# Altium project TTAmp_3T0K.PrjPCB
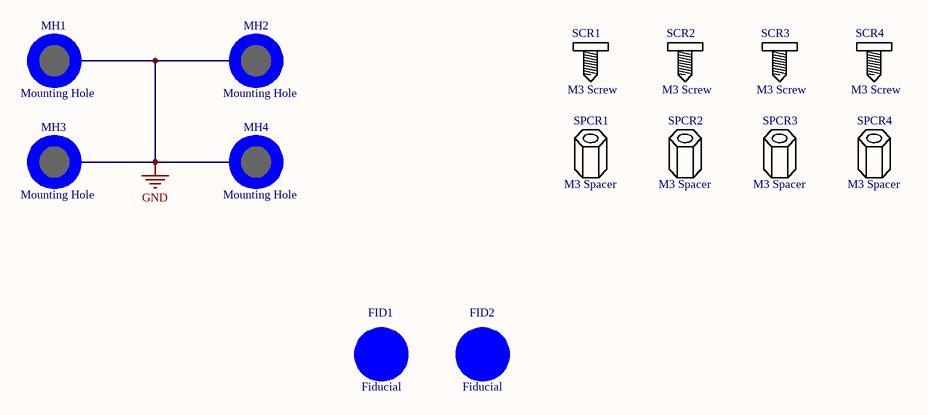
[diagram p0: TTAmp_3T0K_Mechanical.SchDoc]
5 sheets, 153 parts. Net scope: global (net labels, ports and power ports of the same name join across sheets).
Board file: TTAmp_3T0K.PcbDoc
Sheets:
  TTAmp_3T0K_Mechanical.SchDoc
  TTAmp_3T0K_power.SchDoc
  TTAmp_3T0K_amp_tensometer_1.SchDoc
  TTAmp_3T0K_amp_tensometer_2.SchDoc
  TTAmp_3T0K_amp_tensometer_3.SchDoc

## Sheet TTAmp_3T0K_Mechanical.SchDoc
size A4; ApprovedBy: Krzysztof Belewicz; CheckedBy: Krzysztof Belewicz; Author: Krzysztof Belewicz; CompanyName: Koło Naukowe Systemów Scalonych; DrawnBy: Krzysztof Belewicz; Organization: KNSS; Address1: Koło Naukowe; Address2: Systemów Scalonych; Address3: 00-665 Warszawa; Address4: Nowowiejska 15/19; Revision: 0.1; SheetNumber: 5; SheetTotal: 5

### Parts
FID1  Fiducial  [Fiducial]  (no BOM)
FID2  Fiducial  [Fiducial]  (no BOM)
MH1  Mounting Hole  [MH-M3_Copper]  (no BOM)
MH2  Mounting Hole  [MH-M3_Copper]  (no BOM)
MH3  Mounting Hole  [MH-M3_Copper]  (no BOM)
MH4  Mounting Hole  [MH-M3_Copper]  (no BOM)
SCR1  M3 Screw  (mechanical)
SCR2  M3 Screw  (mechanical)
SCR3  M3 Screw  (mechanical)
SCR4  M3 Screw  (mechanical)
SPCR1  M3 Spacer  (mechanical)
SPCR2  M3 Spacer  (mechanical)
SPCR3  M3 Spacer  (mechanical)
SPCR4  M3 Spacer  (mechanical)

### Nets
GND: MH1.MH MH2.MH MH3.MH MH4.MH

### Notes on the sheet
- Project:
- Variant:
- File:
- Sheet:
- Revision:
- Total Sheet:
- Author:
- Modified:

### Library data of the parts
FID1 FID2 = FID
MH1-MH4 = MH: M3 mounting hole
SCR1-SCR4 = SCREW: Supplier 1: *; Manufacturer 1: *; Supplier Part Number 1: *; Manufacturer Part Number 1: *
SPCR1-SPCR4 = SPCR: Supplier 1: *; Manufacturer 1: *; Supplier Part Number 1: *; Manufacturer Part Number 1: *

## Sheet TTAmp_3T0K_power.SchDoc
size A4; ApprovedBy: Krzysztof Belewicz; CheckedBy: Krzysztof Belewicz; Author: Krzysztof Belewicz; CompanyName: Koło Naukowe Systemów Scalonych; DrawnBy: Krzysztof Belewicz; Organization: KNSS; Address1: Koło Naukowe; Address2: Systemów Scalonych; Address3: 00-665 Warszawa; Address4: Nowowiejska 15/19; Revision: 0.1; SheetNumber: 1; SheetTotal: 5
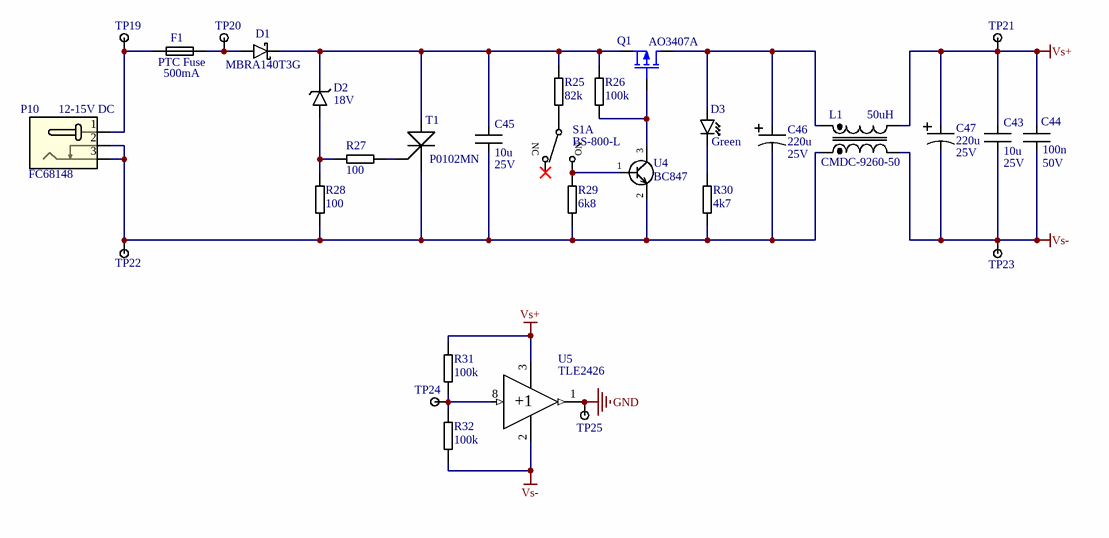
[diagram p1: TTAmp_3T0K_power.SchDoc]

### Parts
(Parts that share a designator on the sheet are numbered #1, #2 ... from top to bottom, then left to right.)
C43  value 10u  MaxVoltage: 25V  [CAPC2012N]  (hidden comment: Capacitor)
C44  value 100n  MaxVoltage: 50V  [CAPC1608N]  (hidden comment: Capacitor)
C45  value 10u  MaxVoltage: 25V  [CAPC2012N]  (hidden comment: Capacitor)
C46  value 220u  MaxVoltage: 25V  [8x10]  (hidden comment: SC1E227M08010VR)
C47  value 220u  MaxVoltage: 25V  [8x10]  (hidden comment: SC1E227M08010VR)
D1  MBRA140T3G  [SMA]
D2  value 18V  [SOD123]  (hidden comment: Zener Diode)
D3  Green  [LED_0603_GREEN]
F1  PTC Fuse  value 500mA  [RESC4532N]
L1  CMDC-9260-50  value 50uH  [CMDC-09260 HF]
P10  12-15V DC  [FC681478]
Q1  AO3407A  [SOT23-3N]
R25  value 82k  [RESC1608N]  (hidden comment: Resistor)
R26  value 100k  [RESC1608N]  (hidden comment: Resistor)
R27  value 100  [RESC1608N]  (hidden comment: Resistor)
R28  value 100  [RESC1608N]  (hidden comment: Resistor)
R29  value 6k8  [RESC1608N]  (hidden comment: Resistor)
R30  value 4k7  [RESC1608N]  (hidden comment: Resistor)
R31  value 100k  [RESC1608N]  (hidden comment: Resistor)
R32  value 100k  [RESC1608N]  (hidden comment: Resistor)
S1#1  BS-800-L  [BS-800-L]  (part A of 2)
T1  P0102MN  [SOT223_N]
TP19  (no value)  [TP-SMD-1.0MM]  (no BOM)
TP20  (no value)  [TP-SMD-1.0MM]  (no BOM)
TP21  (no value)  [TP-SMD-1.0MM]  (no BOM)
TP22  (no value)  [TP-SMD-1.0MM]  (no BOM)
TP23  (no value)  [TP-SMD-1.0MM]  (no BOM)
TP24  (no value)  [TP-SMD-1.0MM]  (no BOM)
TP25  (no value)  [TP-SMD-1.0MM]  (no BOM)
U4  BC847  [SOT323_L]
U5  TLE2426  [SOIC8]

### Nets
GND: TP25.1 U5.1(OUT)
Vs+: C43.2 C44.2 C47.1 L1.4 R31.2 TP21.1 U5.3(IN)
Vs-: C43.1 C44.1 C47.2 L1.3 R32.1 TP23.1 U5.2(COMMON)
NetC45_1: C45.1 C46.2 L1.2 P10.2 P10.3 R28.1 R29.1 R30.1 T1.1(K) TP22.1 U4.2(E)
NetC45_2: C45.2 D1.2 D2.2 Q1.2(S) R25.2 R26.2 T1.2(A)
NetC46_1: C46.1 D3.A L1.1 Q1.3(D)
NetD1_1: D1.1 F1.2 TP20.1
NetD2_1: D2.1 R27.2 R28.2
NetD3_K: D3.K R30.2
NetF1_1: F1.1 P10.1 TP19.1
NetQ1_1: Q1.1(G) R26.1 U4.3(C)
NetR25_1: R25.1 S1#1.2(COM_1)
NetR27_1: R27.1 T1.3(G)
NetR29_2: R29.2 S1#1.3(NO_1) U4.1(B)
NetR31_1: R31.1 R32.2 TP24.1 U5.8(NOISE_REDUCTION)

Not connected (* = marked no-connect by the designer): S1#1 1(NC_1)*

### Notes on the sheet
- Project:
- Variant:
- File:
- Sheet:
- Revision:
- Total Sheet:
- Author:
- Modified:
- (in symbol BS-800-L, part A) NC; NO
- (in symbol TLE2426) +1

### Library data of the parts
C43-C45 = Capacitor: Tolerance: 10%; Supplier 1: TME; Supplier 2: *
  C43 C45: Supplier Part Number 1: GRM21BR61E106KA73L
  C44: Supplier Part Number 1: CL10B104KB8NNNC
C46 C47 = Capacitor Polarized: Manufacturer 1: SAMWHA; Tolerance: 20%; Supplier 1: TME; Supplier Part Number 1: SC1E227M08010VR; Manufacturer Part Number 1: SC1E227M08010VR
D1 = MBRA140T3G: Dioda: prostownicza Schottky; SMD; 40V; 1A; SMA; pin to pad: 1>A 2>K; Manufacturer 1: ON SEMICONDUCTOR; Supplier 1: TME; Supplier Part Number 1: MBRA140T3G; Manufacturer Part Number 1: MBRA140T3G
D2 = MMSZ5227BT1G: Zener Diode 18V 0.5W smd SOD123; Manufacturer 1: ON SEMICONDUCTOR; Manufacturer Part Number 1: MMSZ18T1G; Supplier 1: TME; Supplier Part Number 1: MMSZ18T1G
D3 = LED_SMD_0603: LED 0603; Manufacturer 1: OPTOSUPPLY; Manufacturer Part Number 1: OSG80603C1E; Voltage: 1.6-2.4V; MaxCurrent: 5mA; Supplier 1: TME; Supplier Part Number 1: OSG80603C1E; Color: Green
F1 = SD075-16: PTC Fuse 750mA; Manufacturer 1: ECE; Manufacturer Part Number 1: SD050-16; Max Voltage: 16V; Supplier 1: TME; Supplier Part Number 1: SD075-16; Supplier 2: *; Supplier Part Number 2: *; Stand Current: 500mA
L1 = CMDC-9260-50: Dławik: common mode; SMD; 800mA; 320mΩ; Ind.poj.uzw:50uH; Il.uzw:2; Manufacturer 1: FERROCORE; Max Voltage: 80VDC; Resistance: 320mOhm; Manufacturer Part Number 1: CMDC-9260-50; Supplier 1: TME; Supplier Part Number 1: CMDC-9260-50; Max Current: 800mA
P10 = FC68148: Socket; Barrel jack DC; male; 5,5/2,1mm; THT; Manufacturer Part Number 1: DC-10A FC68148; Manufacturer 1: Cliff; Max Voltage: 12VDC; Max Current: 5A; Supplier 1: TME; Supplier Part Number 1: FC68148
Q1 = MOSFET-P: P-Channel MOSFET; Manufacturer 1: ALPHA & OMEGA SEMICONDUCTOR; Supplier Part Number 1: AO3407A; Supplier 1: TME; Manufacturer Part Number 1: AO3407A
R25 = Resistor: Manufacturer 1: WALSIN; Manufacturer Part Number 1: WF06P823JTL; Tolerance: 5%; Power: 0.125W; Supplier 1: TME; Supplier Part Number 1: WF06P-82K-5%
R26 R31 R32 = Resistor: Manufacturer 1: ROYAL OHM; Manufacturer Part Number 1: HP03W5J0104T5E; Tolerance: 5%; Power: 0.2W; Supplier 1: TME; Supplier Part Number 1: HP03-100K5%
R27 = Resistor: Manufacturer 1: WALSIN; Manufacturer Part Number 1: WF06P101JTL; Tolerance: 5%; Power: 0.125W; Supplier 1: TME; Supplier Part Number 1: WF06P-100R-5%
R28 = Resistor: Manufacturer Part Number 1: WF06P101JTL; Manufacturer 1: WALSIN; Tolerance: 5%; Power: 0.125W; Supplier 1: TME; Supplier Part Number 1: WF06P-100R-5%
R29 = Resistor: Manufacturer Part Number 1: RC0603JR-076K8L; Manufacturer 1: YAGEO; Tolerance: 5%; Power: 0.1W; Supplier 1: TME; Supplier Part Number 1: RC0603JR-076K8
R30 = Resistor: Manufacturer Part Number 1: WF06P472JTL; Manufacturer 1: WALSIN; Tolerance: 5%; Power: 0.125W; Supplier 1: TME; Supplier Part Number 1: WF06P-4K7-5%
S1#1 = BS-800-L: Manufacturer 1: CANAL ELECTRONIC; Max Current: 0.1A; Max Voltage: 30VDC; Manufacturer Part Number 1: BS-800-L; Supplier Part Number 1: BS800L; Supplier 1: TME
T1 = P0102MN 5AA4: Manufacturer 1: ST MICROELECTRONICS; Manufacturer Part Number 1: P0102MN 5AA4; Supplier 1: TME; Supplier Part Number 1: P0102MN-5AA4
TP19-TP25 = TP1: Test Point for probe
U4 = BC847AW.115: Tranzystor: NPN; bipolarny; 45V; 200mA; 200mW; SOT323; Manufacturer 1: NEXPERIA; Manufacturer Part Number 1: BC847AW.115; Supplier 1: TME; Supplier Part Number 1: BC847AW.115
U5 = TLE2426: Texas Instrument Low-Noise JFET-Input Operational Amplifier; Manufacturer 1: TEXAS INSTRUMENTS; Manufacturer Part Number 1: TLE2426ID; Supplier 1: Farnell; Supplier Part Number 1: 8454833

## Sheet TTAmp_3T0K_amp_tensometer_1.SchDoc
size A4; ApprovedBy: Krzysztof Belewicz; CheckedBy: Krzysztof Belewicz; Author: Krzysztof Belewicz; CompanyName: Koło Naukowe Systemów Scalonych; DrawnBy: Krzysztof Belewicz; Organization: KNSS; Address1: Koło Naukowe; Address2: Systemów Scalonych; Address3: 00-665 Warszawa; Address4: Nowowiejska 15/19; Revision: 0.1; SheetNumber: 2; SheetTotal: 5
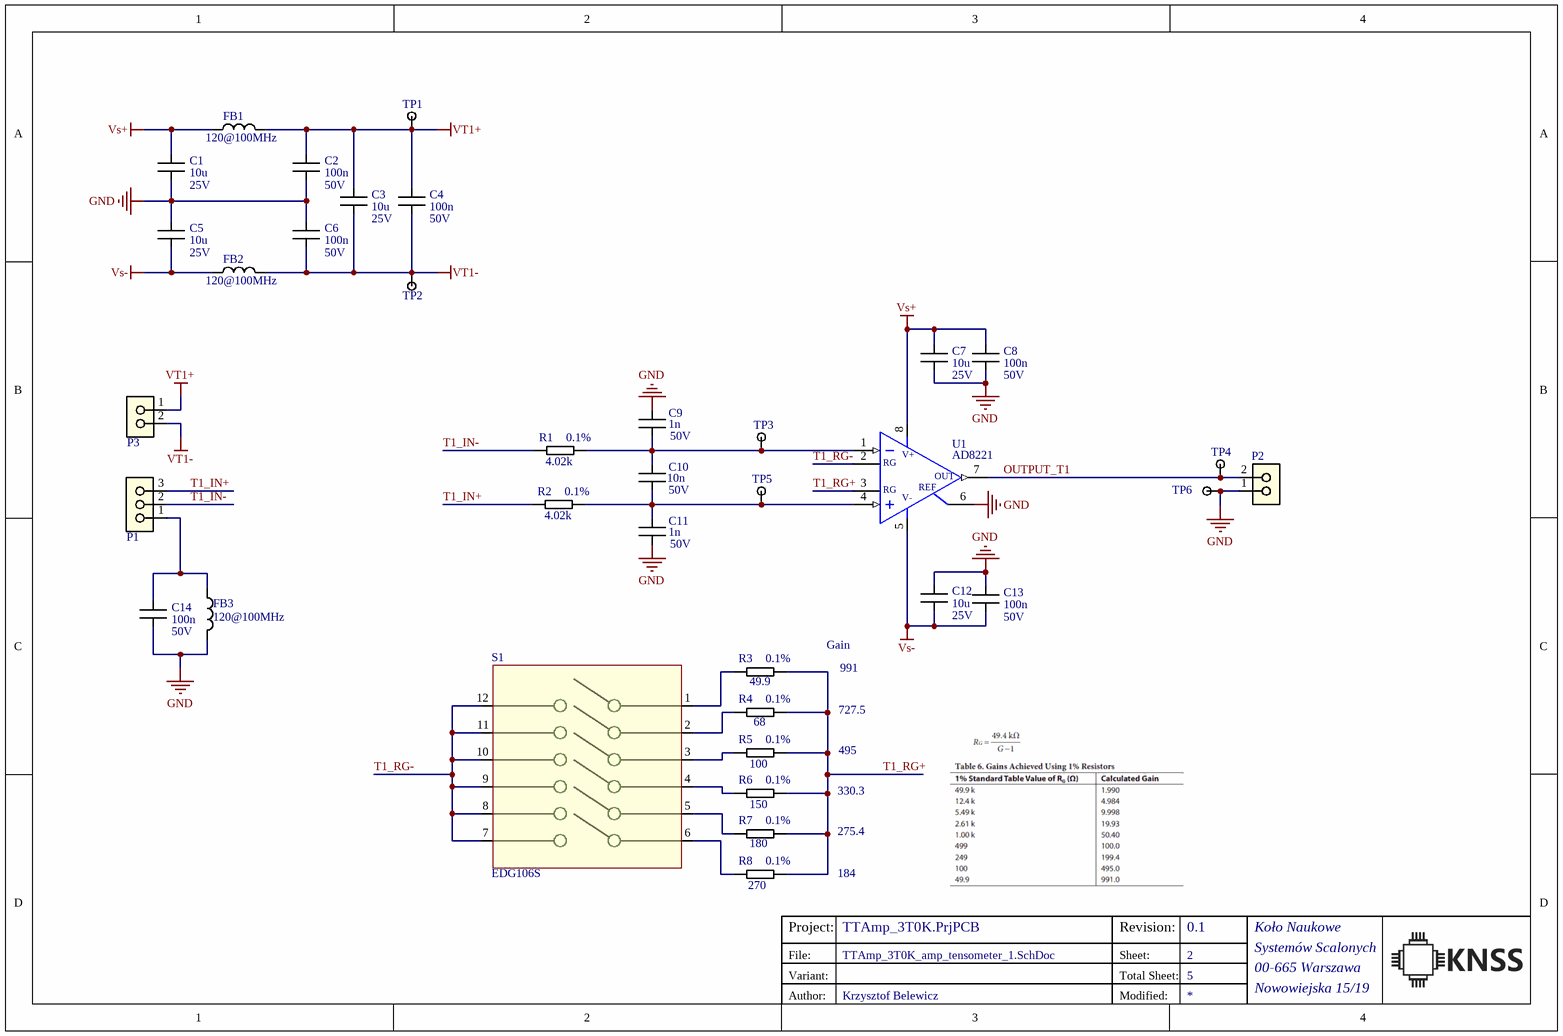
[diagram p2: TTAmp_3T0K_amp_tensometer_1.SchDoc]

### Parts
(Parts that share a designator on the sheet are numbered #1, #2 ... from top to bottom, then left to right.)
C1  value 10u  MaxVoltage: 25V  [CAPC2012N]  (hidden comment: Capacitor)
C2  value 100n  MaxVoltage: 50V  [CAPC1608N]  (hidden comment: Capacitor)
C3  value 10u  MaxVoltage: 25V  [CAPC2012N]  (hidden comment: Capacitor)
C4  value 100n  MaxVoltage: 50V  [CAPC1608N]  (hidden comment: Capacitor)
C5  value 10u  MaxVoltage: 25V  [CAPC2012N]  (hidden comment: Capacitor)
C6  value 100n  MaxVoltage: 50V  [CAPC1608N]  (hidden comment: Capacitor)
C7  value 10u  MaxVoltage: 25V  [CAPC2012N]  (hidden comment: Capacitor)
C8  value 100n  MaxVoltage: 50V  [CAPC1608N]  (hidden comment: Capacitor)
C9  value 1n  MaxVoltage: 50V  [CAPC1608N]  (hidden comment: Capacitor)
C10  value 10n  MaxVoltage: 50V  [CAPC1608N]  (hidden comment: Capacitor)
C11  value 1n  MaxVoltage: 50V  [CAPC1608N]  (hidden comment: Capacitor)
C12  value 10u  MaxVoltage: 25V  [CAPC2012N]  (hidden comment: Capacitor)
C13  value 100n  MaxVoltage: 50V  [CAPC1608N]  (hidden comment: Capacitor)
C14  value 100n  MaxVoltage: 50V  [CAPC1608N]  (hidden comment: Capacitor)
FB1  value 120@100MHz  [INDC1608N]  (hidden comment: Ferrite Bead)
FB2  value 120@100MHz  [INDC1608N]  (hidden comment: Ferrite Bead)
FB3  value 120@100MHz  [INDC1608N]  (hidden comment: Ferrite Bead)
P1  AK100/3DS-5,0-V/GRAU  [AK100/3DS-5,0-V/GRAU]  (value not drawn)
P2  AK100/2DS-5,0-V/GRAU  [AK100/2DS-5,0-V/GRAU]  (value not drawn)
P3  AK100/2DS-5,0-V/GRAU  [AK100/2DS-5,0-V/GRAU]  (value not drawn)
R1  value 4.02k  Tolerance: 0.1%  [RESC1608N]  (hidden comment: Resistor)
R2  value 4.02k  Tolerance: 0.1%  [RESC1608N]  (hidden comment: Resistor)
R3  value 49.9  Tolerance: 0.1%  [RESC1608N]  (hidden comment: Resistor)
R4  value 68  Tolerance: 0.1%  [RESC1608N]  (hidden comment: Resistor)
R5  value 100  Tolerance: 0.1%  [RESC1608N]  (hidden comment: Resistor)
R6  value 150  Tolerance: 0.1%  [RESC1608N]  (hidden comment: Resistor)
R7  value 180  Tolerance: 0.1%  [RESC1608N]  (hidden comment: Resistor)
R8  value 270  Tolerance: 0.1%  [RESC1608N]  (hidden comment: Resistor)
S1#2  EDG106S  [EDG106S]
TP1  (no value)  [TP-SMD-1.0MM]  (no BOM)
TP2  (no value)  [TP-SMD-1.0MM]  (no BOM)
TP3  (no value)  [TP-SMD-1.0MM]  (no BOM)
TP4  (no value)  [TP-SMD-1.0MM]  (no BOM)
TP5  (no value)  [TP-SMD-1.0MM]  (no BOM)
TP6  (no value)  [TP-SMD-1.0MM]  (no BOM)
U1  AD8221  [R-8_N]

### Nets
GND: C1.1 C2.1 C5.2 C6.2 C7.1 C8.1 C9.2 C11.1 C12.2 C13.2 C14.1 FB3.2 P2.1 TP6.1 U1.6(REF)
Vs+: C1.2 C7.2 C8.2 FB1.2 U1.8(V+)
Vs-: C5.1 C12.1 C13.1 FB2.2 U1.5(V-)
VT1+: C2.2 C3.2 C4.2 FB1.1 P3.1 TP1.1
VT1-: C3.1 C4.1 C6.1 FB2.1 P3.2 TP2.1
OUTPUT_T1: P2.2 TP4.1 U1.7(OUT)
T1_IN+: P1.3 R2.2
T1_IN-: P1.2 R1.2
T1_RG+: R3.1 R4.1 R5.1 R6.1 R7.1 R8.1 U1.3(RG)
T1_RG-: S1#2.7 S1#2.8 S1#2.9 S1#2.10 S1#2.11 S1#2.12 U1.2(RG)
NetC9_1: C9.1 C10.2 R1.1 TP3.1 U1.1(-IN)
NetC10_1: C10.1 C11.2 R2.1 TP5.1 U1.4(+IN)
NetC14_2: C14.2 FB3.1 P1.1
NetR3_2: R3.2 S1#2.1
NetR4_2: R4.2 S1#2.2
NetR5_2: R5.2 S1#2.3
NetR6_2: R6.2 S1#2.4
NetR7_2: R7.2 S1#2.5
NetR8_2: R8.2 S1#2.6

### Notes on the sheet
- Gain
- 727.5
- 991
- 495
- 330.3
- 275.4
- 184
- Project:
- Variant:
- File:
- Sheet:
- Revision:
- Total Sheet:
- Author:
- Modified:

### Library data of the parts
C1-C9 C11-C14 = Capacitor: Tolerance: 10%; Supplier 1: TME; Supplier 2: *
  C1 C3 C5 C7 C12: Supplier Part Number 1: GRM21BR61E106KA73L
  C2 C4 C6 C8 C13 C14: Supplier Part Number 1: CL10B104KB8NNNC
  C9 C11: Supplier Part Number 1: VJ0603Y102KXACW1BC
C10 = Capacitor: Tolerance: 20%; Supplier 1: TME; Supplier 2: *; Supplier Part Number 1: VJ0603Y103MXACW1BC
FB1-FB3 = Inductor: Max Current: 3A; Tolerance: *; Supplier 1: TME; Supplier 2: *; Supplier Part Number 1: BLM18KG121TN1D
P1 = AK100/3DS-5,0-V/GRAU: Listwa zaciskowa do druku; kątowe 90°; 5mm; tory:3; na PCB; 24A; Manufacturer: PTR MESSTECHNIK; Supplier Part Number 1: TB-5.0-P-3P-12; Supplier 1: TME; Manufacturer Part Number: AK100/3DS-5,0-V/GRAU
P2 P3 = AK100/2DS-5,0-V/GRAU: Listwa zaciskowa do druku; kątowe 90°; 5mm; tory:2; na PCB; 24A; Manufacturer: PTR MESSTECHNIK; Supplier Part Number 1: TB-5.0-P-2P-12; Supplier 1: TME; Manufacturer Part Number: AK100/2DS-5,0-V/GRAU
R1 R2 = Resistor: Manufacturer Part Number 1: AR03BTCX4021; Manufacturer 1: VIKING; Power: 0.1W; Supplier 1: TME; Supplier Part Number 1: AR0603-4K02-0.1%
R3 = Resistor: Manufacturer 1: VIKING; Manufacturer Part Number 1: AR03BTCX49R9; Power: 0.1W; Supplier 1: TME; Supplier Part Number 1: AR0603-49R9-0.1%
R4 = Resistor: Manufacturer Part Number 1: AR03BTCX0680; Manufacturer: VIKING; Power: 0.1W; Supplier 1: TME; Supplier Part Number 1: AR0603-68R-0.1%
R5 = Resistor: Manufacturer Part Number 1: AR03BTCX1000; Manufacturer 1: VIKING; Power: 0.1W; Supplier 1: TME; Supplier Part Number 1: AR0603-100R-0.1%
R6 = Resistor: Manufacturer Part Number 1: AR03BTCX1500; Manufacturer 1: VIKING; Power: 0.1W; Supplier 1: TME; Supplier Part Number 1: AR0603-150R-0.1%
R7 = Resistor: Manufacturer Part Number 1: AR03BTCX1800; Manufacturer 1: VIKING; Power: 0.1W; Supplier 1: TME; Supplier Part Number 1: AR0603-180R-0.1%
R8 = Resistor: Manufacturer Part Number 1: AR03BTCX2700; Manufacturer 1: VIKING; Power: 0.1W; Supplier 1: TME; Supplier Part Number 1: AR0603-180R-0.1%
S1#2 = EDG106S: Przełącznik: DIP-SWITCH; Ilość sekcji:6; ON-OFF; 0,1A/24VDC; 500V; Manufacturer 1: ECE; Manufacturer Part Number 1: EDG106S; Supplier 1: TME; Supplier Part Number 1: EDG106S
TP1-TP6 = TP1: Test Point for probe
U1 = AD8221: Precision Instrumentation Amplifier; Manufacturer Part Number 1: AD8221BRZ; Manufacturer 1: ANALOG DEVICES; PackageReference 1: SOIC_N; ComponentLink1Description: Manufacturer Link; ComponentLink1URL: http://www.analog.com/en/prod/0%2C2877%2CAD622%2C00.html; ComponentLink2Description: Datasheet; ComponentLink2URL: http://www.analog.com/UploadedFiles/Data_Sheets/218546992AD622_c.pdf; Supplier 1: TME; Supplier Part Number 1: AD8221BRZ

## Sheet TTAmp_3T0K_amp_tensometer_2.SchDoc
size A4; ApprovedBy: Krzysztof Belewicz; CheckedBy: Krzysztof Belewicz; Author: Krzysztof Belewicz; CompanyName: Koło Naukowe Systemów Scalonych; DrawnBy: Krzysztof Belewicz; Organization: KNSS; Address1: Koło Naukowe; Address2: Systemów Scalonych; Address3: 00-665 Warszawa; Address4: Nowowiejska 15/19; Revision: 0.1; SheetNumber: 3; SheetTotal: 5
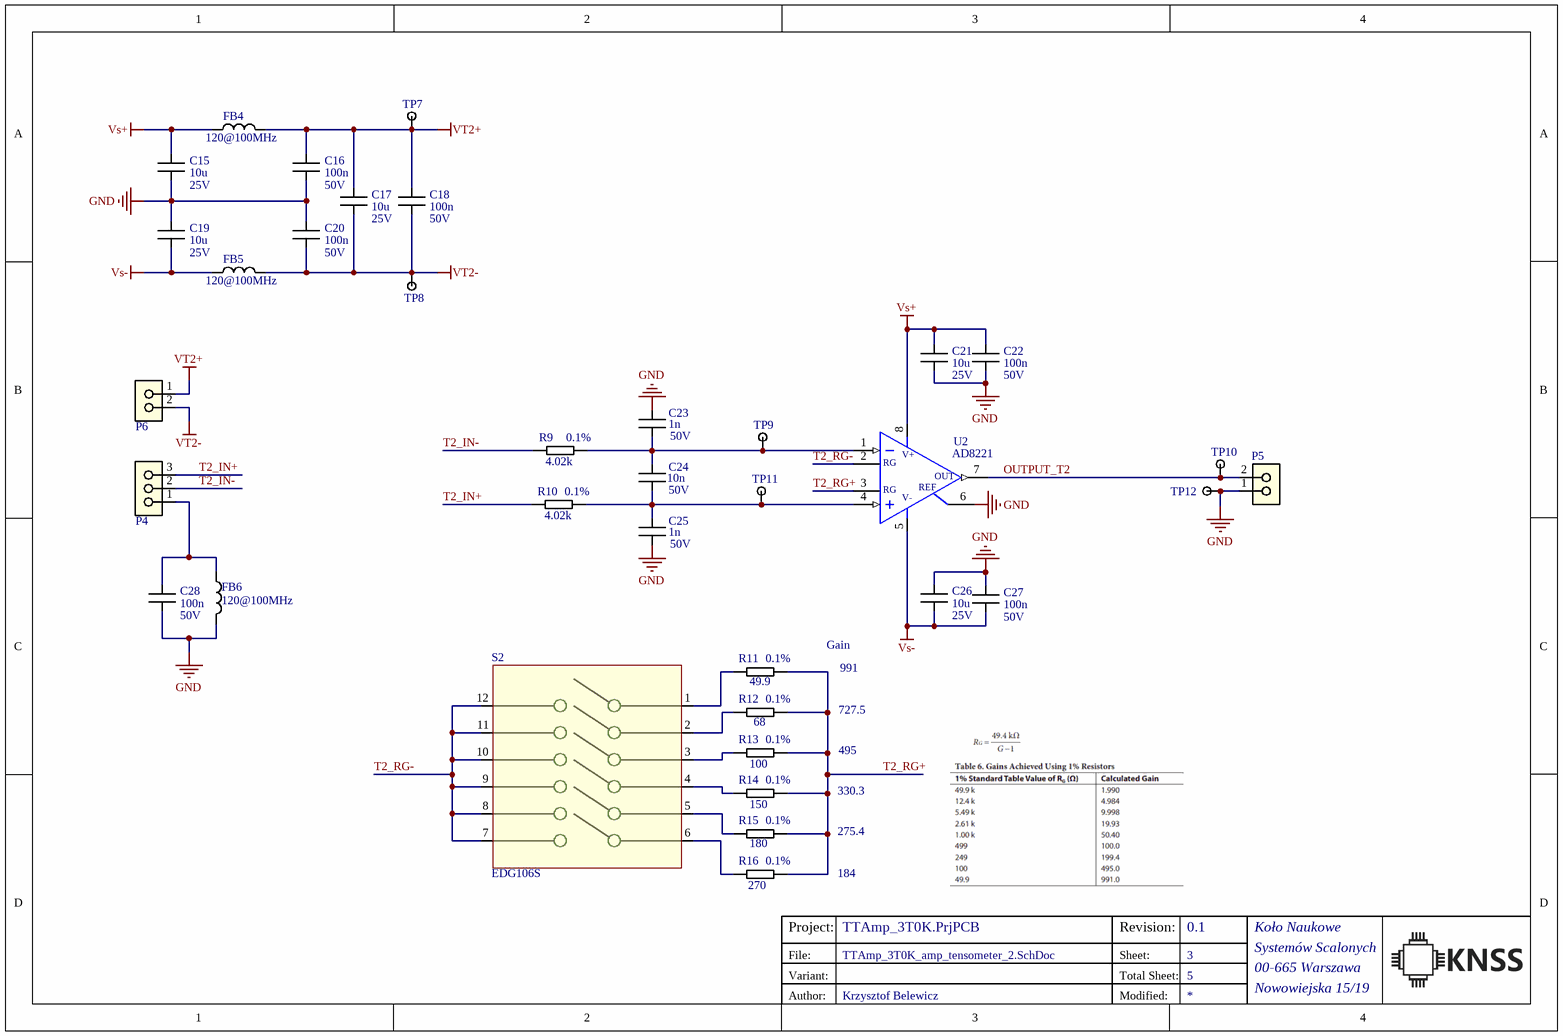
[diagram p3: TTAmp_3T0K_amp_tensometer_2.SchDoc]

### Parts
C15  value 10u  MaxVoltage: 25V  [CAPC2012N]  (hidden comment: Capacitor)
C16  value 100n  MaxVoltage: 50V  [CAPC1608N]  (hidden comment: Capacitor)
C17  value 10u  MaxVoltage: 25V  [CAPC2012N]  (hidden comment: Capacitor)
C18  value 100n  MaxVoltage: 50V  [CAPC1608N]  (hidden comment: Capacitor)
C19  value 10u  MaxVoltage: 25V  [CAPC2012N]  (hidden comment: Capacitor)
C20  value 100n  MaxVoltage: 50V  [CAPC1608N]  (hidden comment: Capacitor)
C21  value 10u  MaxVoltage: 25V  [CAPC2012N]  (hidden comment: Capacitor)
C22  value 100n  MaxVoltage: 50V  [CAPC1608N]  (hidden comment: Capacitor)
C23  value 1n  MaxVoltage: 50V  [CAPC1608N]  (hidden comment: Capacitor)
C24  value 10n  MaxVoltage: 50V  [CAPC1608N]  (hidden comment: Capacitor)
C25  value 1n  MaxVoltage: 50V  [CAPC1608N]  (hidden comment: Capacitor)
C26  value 10u  MaxVoltage: 25V  [CAPC2012N]  (hidden comment: Capacitor)
C27  value 100n  MaxVoltage: 50V  [CAPC1608N]  (hidden comment: Capacitor)
C28  value 100n  MaxVoltage: 50V  [CAPC1608N]  (hidden comment: Capacitor)
FB4  value 120@100MHz  [INDC1608N]  (hidden comment: Ferrite Bead)
FB5  value 120@100MHz  [INDC1608N]  (hidden comment: Ferrite Bead)
FB6  value 120@100MHz  [INDC1608N]  (hidden comment: Ferrite Bead)
P4  AK100/3DS-5,0-V/GRAU  [AK100/3DS-5,0-V/GRAU]  (value not drawn)
P5  AK100/2DS-5,0-V/GRAU  [AK100/2DS-5,0-V/GRAU]  (value not drawn)
P6  AK100/2DS-5,0-V/GRAU  [AK100/2DS-5,0-V/GRAU]  (value not drawn)
R9  value 4.02k  Tolerance: 0.1%  [RESC1608N]  (hidden comment: Resistor)
R10  value 4.02k  Tolerance: 0.1%  [RESC1608N]  (hidden comment: Resistor)
R11  value 49.9  Tolerance: 0.1%  [RESC1608N]  (hidden comment: Resistor)
R12  value 68  Tolerance: 0.1%  [RESC1608N]  (hidden comment: Resistor)
R13  value 100  Tolerance: 0.1%  [RESC1608N]  (hidden comment: Resistor)
R14  value 150  Tolerance: 0.1%  [RESC1608N]  (hidden comment: Resistor)
R15  value 180  Tolerance: 0.1%  [RESC1608N]  (hidden comment: Resistor)
R16  value 270  Tolerance: 0.1%  [RESC1608N]  (hidden comment: Resistor)
S2  EDG106S  [EDG106S]
TP7  (no value)  [TP-SMD-1.0MM]  (no BOM)
TP8  (no value)  [TP-SMD-1.0MM]  (no BOM)
TP9  (no value)  [TP-SMD-1.0MM]  (no BOM)
TP10  (no value)  [TP-SMD-1.0MM]  (no BOM)
TP11  (no value)  [TP-SMD-1.0MM]  (no BOM)
TP12  (no value)  [TP-SMD-1.0MM]  (no BOM)
U2  AD8221  [R-8_N]

### Nets
GND: C15.1 C16.1 C19.2 C20.2 C21.1 C22.1 C23.2 C25.1 C26.2 C27.2 C28.1 FB6.2 P5.1 TP12.1 U2.6(REF)
Vs+: C15.2 C21.2 C22.2 FB4.2 U2.8(V+)
Vs-: C19.1 C26.1 C27.1 FB5.2 U2.5(V-)
VT2+: C16.2 C17.2 C18.2 FB4.1 P6.1 TP7.1
VT2-: C17.1 C18.1 C20.1 FB5.1 P6.2 TP8.1
OUTPUT_T2: P5.2 TP10.1 U2.7(OUT)
T2_IN+: P4.3 R10.2
T2_IN-: P4.2 R9.2
T2_RG+: R11.1 R12.1 R13.1 R14.1 R15.1 R16.1 U2.3(RG)
T2_RG-: S2.7 S2.8 S2.9 S2.10 S2.11 S2.12 U2.2(RG)
NetC23_1: C23.1 C24.2 R9.1 TP9.1 U2.1(-IN)
NetC24_1: C24.1 C25.2 R10.1 TP11.1 U2.4(+IN)
NetC28_2: C28.2 FB6.1 P4.1
NetR11_2: R11.2 S2.1
NetR12_2: R12.2 S2.2
NetR13_2: R13.2 S2.3
NetR14_2: R14.2 S2.4
NetR15_2: R15.2 S2.5
NetR16_2: R16.2 S2.6

### Notes on the sheet
- Gain
- 727.5
- 991
- 495
- 330.3
- 275.4
- 184
- Project:
- Variant:
- File:
- Sheet:
- Revision:
- Total Sheet:
- Author:
- Modified:

### Library data of the parts
C15-C23 C25-C28 = Capacitor: Tolerance: 10%; Supplier 1: TME; Supplier 2: *
  C15 C17 C19 C21 C26: Supplier Part Number 1: GRM21BR61E106KA73L
  C16 C18 C20 C22 C27 C28: Supplier Part Number 1: CL10B104KB8NNNC
  C23 C25: Supplier Part Number 1: VJ0603Y102KXACW1BC
C24 = Capacitor: Tolerance: 20%; Supplier 1: TME; Supplier 2: *; Supplier Part Number 1: VJ0603Y103MXACW1BC
FB4-FB6 = Inductor: Max Current: 3A; Tolerance: *; Supplier 1: TME; Supplier 2: *; Supplier Part Number 1: BLM18KG121TN1D
P4 = AK100/3DS-5,0-V/GRAU: as P1 on sheet TTAmp_3T0K_amp_tensometer_1; Supplier Part Number 1: TB-5.0-P-3P-12; Supplier 1: TME; Manufacturer Part Number: AK100/3DS-5,0-V/GRAU
P5 P6 = AK100/2DS-5,0-V/GRAU: as P2 on sheet TTAmp_3T0K_amp_tensometer_1; Supplier Part Number 1: TB-5.0-P-2P-12; Supplier 1: TME; Manufacturer Part Number: AK100/2DS-5,0-V/GRAU
R9 R10 = Resistor: as R1 on sheet TTAmp_3T0K_amp_tensometer_1; Supplier 1: TME; Supplier Part Number 1: AR0603-4K02-0.1%
R11 = Resistor: as R3 on sheet TTAmp_3T0K_amp_tensometer_1; Supplier 1: TME; Supplier Part Number 1: AR0603-49R9-0.1%
R12 = Resistor: as R4 on sheet TTAmp_3T0K_amp_tensometer_1; Supplier 1: TME; Supplier Part Number 1: AR0603-68R-0.1%
R13 = Resistor: as R5 on sheet TTAmp_3T0K_amp_tensometer_1; Supplier 1: TME; Supplier Part Number 1: AR0603-100R-0.1%
R14 = Resistor: as R6 on sheet TTAmp_3T0K_amp_tensometer_1; Supplier 1: TME; Supplier Part Number 1: AR0603-150R-0.1%
R15 = Resistor: as R7 on sheet TTAmp_3T0K_amp_tensometer_1; Supplier 1: TME; Supplier Part Number 1: AR0603-180R-0.1%
R16 = Resistor: as R8 on sheet TTAmp_3T0K_amp_tensometer_1; Supplier 1: TME; Supplier Part Number 1: AR0603-180R-0.1%
S2 = EDG106S: as S1#2 on sheet TTAmp_3T0K_amp_tensometer_1; Manufacturer Part Number 1: EDG106S; Supplier 1: TME; Supplier Part Number 1: EDG106S
TP7-TP12 = TP1: Test Point for probe
U2 = AD8221: as U1 on sheet TTAmp_3T0K_amp_tensometer_1; ComponentLink1Description: Manufacturer Link; ComponentLink1URL: http://www.analog.com/en/prod/0%2C2877%2CAD622%2C00.html; ComponentLink2Description: Datasheet; ComponentLink2URL: http://www.analog.com/UploadedFiles/Data_Sheets/218546992AD622_c.pdf; Supplier 1: TME; Supplier Part Number 1: AD8221BRZ

## Sheet TTAmp_3T0K_amp_tensometer_3.SchDoc
size A4; ApprovedBy: Krzysztof Belewicz; CheckedBy: Krzysztof Belewicz; Author: Krzysztof Belewicz; CompanyName: Koło Naukowe Systemów Scalonych; DrawnBy: Krzysztof Belewicz; Organization: KNSS; Address1: Koło Naukowe; Address2: Systemów Scalonych; Address3: 00-665 Warszawa; Address4: Nowowiejska 15/19; Revision: 0.1; SheetNumber: 4; SheetTotal: 5
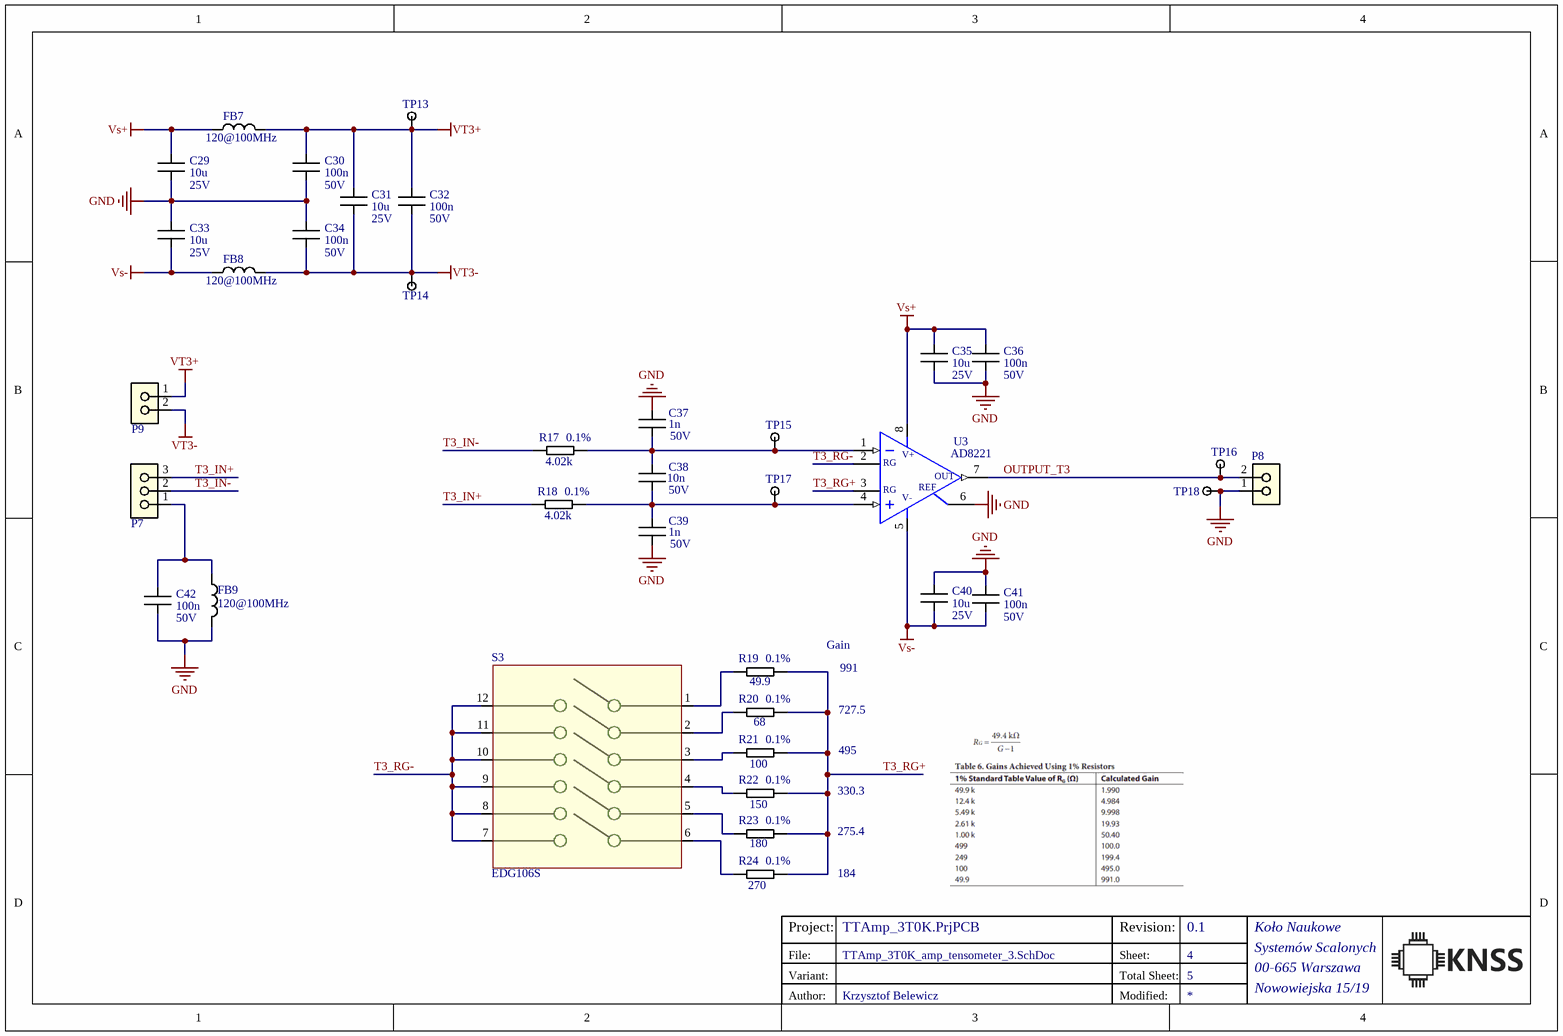
[diagram p4: TTAmp_3T0K_amp_tensometer_3.SchDoc]

### Parts
C29  value 10u  MaxVoltage: 25V  [CAPC2012N]  (hidden comment: Capacitor)
C30  value 100n  MaxVoltage: 50V  [CAPC1608N]  (hidden comment: Capacitor)
C31  value 10u  MaxVoltage: 25V  [CAPC2012N]  (hidden comment: Capacitor)
C32  value 100n  MaxVoltage: 50V  [CAPC1608N]  (hidden comment: Capacitor)
C33  value 10u  MaxVoltage: 25V  [CAPC2012N]  (hidden comment: Capacitor)
C34  value 100n  MaxVoltage: 50V  [CAPC1608N]  (hidden comment: Capacitor)
C35  value 10u  MaxVoltage: 25V  [CAPC2012N]  (hidden comment: Capacitor)
C36  value 100n  MaxVoltage: 50V  [CAPC1608N]  (hidden comment: Capacitor)
C37  value 1n  MaxVoltage: 50V  [CAPC1608N]  (hidden comment: Capacitor)
C38  value 10n  MaxVoltage: 50V  [CAPC1608N]  (hidden comment: Capacitor)
C39  value 1n  MaxVoltage: 50V  [CAPC1608N]  (hidden comment: Capacitor)
C40  value 10u  MaxVoltage: 25V  [CAPC2012N]  (hidden comment: Capacitor)
C41  value 100n  MaxVoltage: 50V  [CAPC1608N]  (hidden comment: Capacitor)
C42  value 100n  MaxVoltage: 50V  [CAPC1608N]  (hidden comment: Capacitor)
FB7  value 120@100MHz  [INDC1608N]  (hidden comment: Ferrite Bead)
FB8  value 120@100MHz  [INDC1608N]  (hidden comment: Ferrite Bead)
FB9  value 120@100MHz  [INDC1608N]  (hidden comment: Ferrite Bead)
P7  AK100/3DS-5,0-V/GRAU  [AK100/3DS-5,0-V/GRAU]  (value not drawn)
P8  AK100/2DS-5,0-V/GRAU  [AK100/2DS-5,0-V/GRAU]  (value not drawn)
P9  AK100/2DS-5,0-V/GRAU  [AK100/2DS-5,0-V/GRAU]  (value not drawn)
R17  value 4.02k  Tolerance: 0.1%  [RESC1608N]  (hidden comment: Resistor)
R18  value 4.02k  Tolerance: 0.1%  [RESC1608N]  (hidden comment: Resistor)
R19  value 49.9  Tolerance: 0.1%  [RESC1608N]  (hidden comment: Resistor)
R20  value 68  Tolerance: 0.1%  [RESC1608N]  (hidden comment: Resistor)
R21  value 100  Tolerance: 0.1%  [RESC1608N]  (hidden comment: Resistor)
R22  value 150  Tolerance: 0.1%  [RESC1608N]  (hidden comment: Resistor)
R23  value 180  Tolerance: 0.1%  [RESC1608N]  (hidden comment: Resistor)
R24  value 270  Tolerance: 0.1%  [RESC1608N]  (hidden comment: Resistor)
S3  EDG106S  [EDG106S]
TP13  (no value)  [TP-SMD-1.0MM]  (no BOM)
TP14  (no value)  [TP-SMD-1.0MM]  (no BOM)
TP15  (no value)  [TP-SMD-1.0MM]  (no BOM)
TP16  (no value)  [TP-SMD-1.0MM]  (no BOM)
TP17  (no value)  [TP-SMD-1.0MM]  (no BOM)
TP18  (no value)  [TP-SMD-1.0MM]  (no BOM)
U3  AD8221  [R-8_N]

### Nets
GND: C29.1 C30.1 C33.2 C34.2 C35.1 C36.1 C37.2 C39.1 C40.2 C41.2 C42.1 FB9.2 P8.1 TP18.1 U3.6(REF)
Vs+: C29.2 C35.2 C36.2 FB7.2 U3.8(V+)
Vs-: C33.1 C40.1 C41.1 FB8.2 U3.5(V-)
VT3+: C30.2 C31.2 C32.2 FB7.1 P9.1 TP13.1
VT3-: C31.1 C32.1 C34.1 FB8.1 P9.2 TP14.1
OUTPUT_T3: P8.2 TP16.1 U3.7(OUT)
T3_IN+: P7.3 R18.2
T3_IN-: P7.2 R17.2
T3_RG+: R19.1 R20.1 R21.1 R22.1 R23.1 R24.1 U3.3(RG)
T3_RG-: S3.7 S3.8 S3.9 S3.10 S3.11 S3.12 U3.2(RG)
NetC37_1: C37.1 C38.2 R17.1 TP15.1 U3.1(-IN)
NetC38_1: C38.1 C39.2 R18.1 TP17.1 U3.4(+IN)
NetC42_2: C42.2 FB9.1 P7.1
NetR19_2: R19.2 S3.1
NetR20_2: R20.2 S3.2
NetR21_2: R21.2 S3.3
NetR22_2: R22.2 S3.4
NetR23_2: R23.2 S3.5
NetR24_2: R24.2 S3.6

### Notes on the sheet
- Gain
- 727.5
- 991
- 495
- 330.3
- 275.4
- 184
- Project:
- Variant:
- File:
- Sheet:
- Revision:
- Total Sheet:
- Author:
- Modified:

### Library data of the parts
C29-C37 C39-C42 = Capacitor: Tolerance: 10%; Supplier 1: TME; Supplier 2: *
  C29 C31 C33 C35 C40: Supplier Part Number 1: GRM21BR61E106KA73L
  C30 C32 C34 C36 C41 C42: Supplier Part Number 1: CL10B104KB8NNNC
  C37 C39: Supplier Part Number 1: VJ0603Y102KXACW1BC
C38 = Capacitor: Tolerance: 20%; Supplier 1: TME; Supplier 2: *; Supplier Part Number 1: VJ0603Y103MXACW1BC
FB7-FB9 = Inductor: Max Current: 3A; Tolerance: *; Supplier 1: TME; Supplier 2: *; Supplier Part Number 1: BLM18KG121TN1D
P7 = AK100/3DS-5,0-V/GRAU: as P1 on sheet TTAmp_3T0K_amp_tensometer_1; Supplier Part Number 1: TB-5.0-P-3P-12; Supplier 1: TME; Manufacturer Part Number: AK100/3DS-5,0-V/GRAU
P8 P9 = AK100/2DS-5,0-V/GRAU: as P2 on sheet TTAmp_3T0K_amp_tensometer_1; Supplier Part Number 1: TB-5.0-P-2P-12; Supplier 1: TME; Manufacturer Part Number: AK100/2DS-5,0-V/GRAU
R17 R18 = Resistor: as R1 on sheet TTAmp_3T0K_amp_tensometer_1; Supplier 1: TME; Supplier Part Number 1: AR0603-4K02-0.1%
R19 = Resistor: as R3 on sheet TTAmp_3T0K_amp_tensometer_1; Supplier 1: TME; Supplier Part Number 1: AR0603-49R9-0.1%
R20 = Resistor: as R4 on sheet TTAmp_3T0K_amp_tensometer_1; Supplier 1: TME; Supplier Part Number 1: AR0603-68R-0.1%
R21 = Resistor: as R5 on sheet TTAmp_3T0K_amp_tensometer_1; Supplier 1: TME; Supplier Part Number 1: AR0603-100R-0.1%
R22 = Resistor: as R6 on sheet TTAmp_3T0K_amp_tensometer_1; Supplier 1: TME; Supplier Part Number 1: AR0603-150R-0.1%
R23 = Resistor: as R7 on sheet TTAmp_3T0K_amp_tensometer_1; Supplier 1: TME; Supplier Part Number 1: AR0603-180R-0.1%
R24 = Resistor: as R8 on sheet TTAmp_3T0K_amp_tensometer_1; Supplier 1: TME; Supplier Part Number 1: AR0603-180R-0.1%
S3 = EDG106S: as S1#2 on sheet TTAmp_3T0K_amp_tensometer_1; Manufacturer Part Number 1: EDG106S; Supplier 1: TME; Supplier Part Number 1: EDG106S
TP13-TP18 = TP1: Test Point for probe
U3 = AD8221: as U1 on sheet TTAmp_3T0K_amp_tensometer_1; ComponentLink1Description: Manufacturer Link; ComponentLink1URL: http://www.analog.com/en/prod/0%2C2877%2CAD622%2C00.html; ComponentLink2Description: Datasheet; ComponentLink2URL: http://www.analog.com/UploadedFiles/Data_Sheets/218546992AD622_c.pdf; Supplier 1: TME; Supplier Part Number 1: AD8221BRZ

## Nets that join several sheets
GND: TTAmp_3T0K_Mechanical (MH1.MH MH2.MH MH3.MH MH4.MH), TTAmp_3T0K_power (TP25.1 U5.1), TTAmp_3T0K_amp_tensometer_1 (15 pins), TTAmp_3T0K_amp_tensometer_2 (15 pins), TTAmp_3T0K_amp_tensometer_3 (15 pins)
Vs+: TTAmp_3T0K_power (7 pins), TTAmp_3T0K_amp_tensometer_1 (5 pins), TTAmp_3T0K_amp_tensometer_2 (5 pins), TTAmp_3T0K_amp_tensometer_3 (5 pins)
Vs-: TTAmp_3T0K_power (7 pins), TTAmp_3T0K_amp_tensometer_1 (5 pins), TTAmp_3T0K_amp_tensometer_2 (5 pins), TTAmp_3T0K_amp_tensometer_3 (5 pins)

## Assembly variants
5.5/2.1mm DC Jack: all parts fitted
5.5/2.5mm DC Jack: all parts fitted